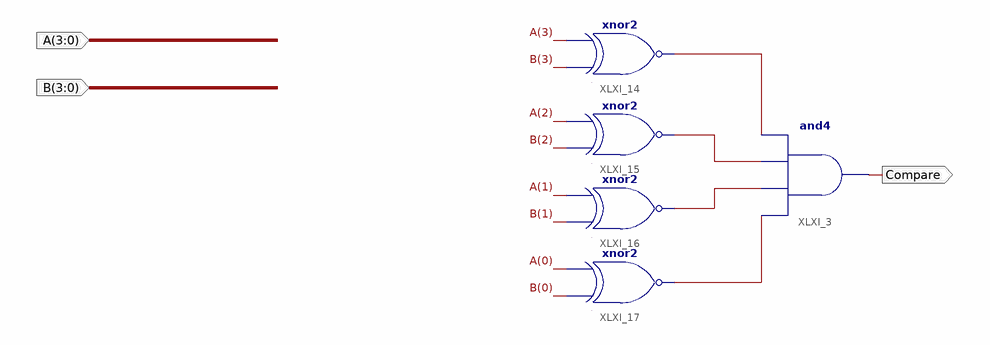
[diagram p0: schematic sheet 1]
// Xilinx ISE schematic Comparator.sch (spartan6) as structural Verilog: 5 symbols, 3 ports
module Comparator (
  input  [3:0] A,
  input  [3:0] B,
  output Compare
);

  wire XLXN_33, XLXN_34, XLXN_35, XLXN_36;

  and XLXI_3 (Compare, XLXN_36, XLXN_35, XLXN_34, XLXN_33);
  xnor XLXI_14 (XLXN_33, B[3], A[3]);
  xnor XLXI_15 (XLXN_34, B[2], A[2]);
  xnor XLXI_16 (XLXN_35, B[1], A[1]);
  xnor XLXI_17 (XLXN_36, B[0], A[0]);
endmodule
